# Altium schematic sheet 02_IO_Interface.SchDoc
size A3; SheetNumber: 3; SheetTotal: 3
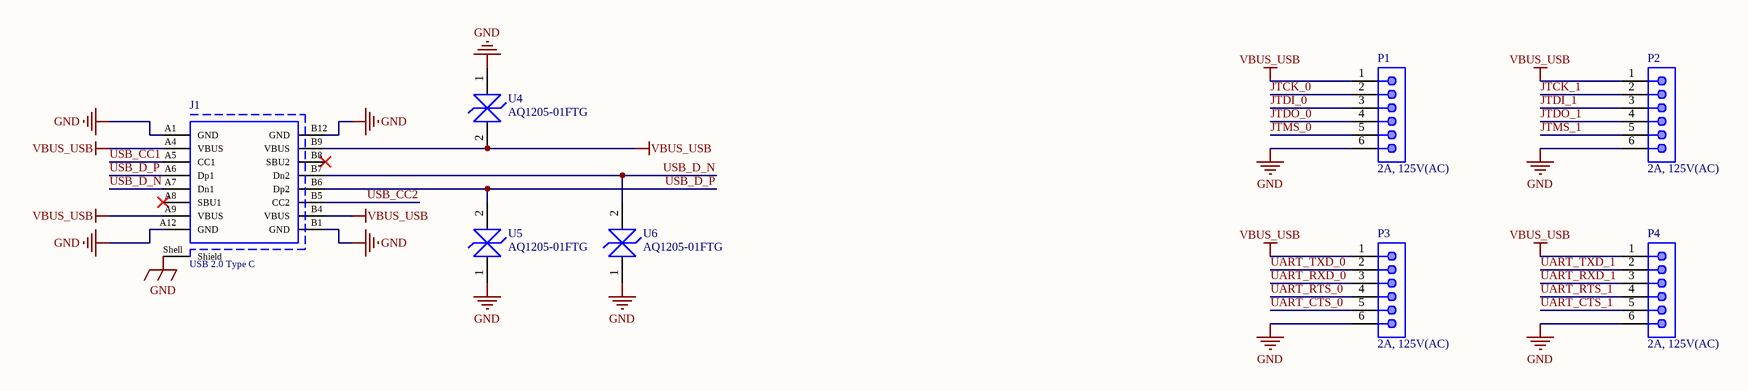
[diagram p0: 02_IO_Interface.SchDoc]

## Parts
J1  USB 2.0 Type C  [USB4105-GF-A]
P1  2A, 125V(AC)  [62000611622]
P2  2A, 125V(AC)  [62000611622]
P3  2A, 125V(AC)  [62000611622]
P4  2A, 125V(AC)  [62000611622]
U4  AQ1205-01FTG  [SOD323]
U5  AQ1205-01FTG  [SOD323]
U6  AQ1205-01FTG  [SOD323]

## Nets
GND: J1.A1(GND) J1.A12(GND) J1.B1(GND) J1.B12(GND) J1.Shell(Shield) P1.6 P2.6 P3.6 P4.6 U4.1 U5.1 U6.1
VBUS_USB: J1.A4(VBUS) J1.A9(VBUS) J1.B4(VBUS) J1.B9(VBUS) P1.1 P2.1 P3.1 P4.1 U4.2
JTCK_0: P1.2
JTCK_1: P2.2
JTDI_0: P1.3
JTDI_1: P2.3
JTDO_0: P1.4
JTDO_1: P2.4
JTMS_0: P1.5
JTMS_1: P2.5
UART_CTS_0: P3.5
UART_CTS_1: P4.5
UART_RTS_0: P3.4
UART_RTS_1: P4.4
UART_RXD_0: P3.3
UART_RXD_1: P4.3
UART_TXD_0: P3.2
UART_TXD_1: P4.2
USB_CC1: J1.A5(CC1)
USB_CC2: J1.B5(CC2)
USB_D_N: J1.A7(Dn1) J1.B7(Dn2) U6.2
USB_D_P: J1.A6(Dp1) J1.B6(Dp2) U5.2

Not connected (* = marked no-connect by the designer): J1 A8(SBU1)* B8(SBU2)*

## Notes on the sheet
- APPROVALS
- DATE
- PROJECT
- BOM:
- REFERENCE DOCUMENTS
- TITLE
- PROJECT REVISION
- DOCUMENT REVISION
- ASSY DWG:
- FAB DWG:
- PCB DWG:
- SIZE:
- A3
- FILE NAME:
- REV
- SHEET
- OF

## Library data of the parts
J1 = USB4105-GF-A: USB Connectors USB Type C,2.0, Rec,SMT, 0.95mmTH Shell Stakes,G/F,RA,Top Mnt,T&R; Manufacturer: GCT; Rated Current: 5 A; Gender: Receptacle; Contact Resistance: 30 mOhm; Working Voltage: 48 VDC; Number of Contacts: 16 Contact; Number of Ports: 1 Port; ComponentLink1Description: Datasheet; ComponentLink1URL: https://www.mouser.vn/datasheet/2/837/Global_Connector_Technology_usb4105-3106202.pdf; Published Date: September 2018; Orientation: Horizontal; Connector Type: USB 2.0 Type C; Operating Temperature: -40 to 105 degC; Packaging: Tape and Reel; Supplier 1 URL: https://www.mouser.vn/ProductDetail/GCT/USB4105-GF-A?qs=KUoIvG%2F9IlY%2FMLlBMpStpA%3D%3D; Supplier 2 URL: N/A; Supplier 3 SN: N/A; Supplier 3 URL: https://www.thegioiic.com/cong-usb-cai-3-1-type-c-16-chan-thang-dan-smd; Value: USB 2.0 Type C; LCSC Part #: C2765186; Manufacturer Part Number: USB4105-GF-A; Mount: SMD/SMT; Package / Case: N/A; Supplier 1: Mouser; Supplier 1 Part Number: 640-USB4105-GF-A; Supplier 2: Digi-Key; Supplier 2 Part Number: N/A; Supplier 3: thegioiic; Supplier 3 Part Number: N/A
P1-P4 = 62000611622: WR-WTB Male Vertical Shrouded Header, pitch 2mm, 6p; Manufacturer: Wurth Elektronik; Pin Number: 6; Contact Resistance: 20mOhm; Withstanding Voltage: 800VAC; Working Voltage: 125VAC; ComponentLink1Description: Datasheet; ComponentLink1URL: https://www.we-online.com/catalog/datasheet/62000611622.pdf; Pitch: 2mm; Packaging: Bag; Part Number: 62000611622; Gender: Male; Type: Vertical; Rated Current: 2A; Supplier 1 URL: https://www.mouser.vn/ProductDetail/Wurth-Elektronik/62000611622?qs=ulEaXIWI0c%2F38WR3e0VejA%3D%3D; Supplier 2 URL: N/A; Supplier 3 URL: https://www.thegioiic.com/dau-ph-2-0mm-6-chan-thang-xuyen-lo; Value: 2A, 125V(AC); LCSC Part #: N/A; Manufacturer Part Number: 62000611622; Mount: THT; Operating Temperature Max: + 85 C; Operating Temperature Min: - 25 C; Package / Case: 6; Supplier 1: Mouser; Supplier 1 Part Number: 710-62000611622; Supplier 2: Digi-Key; Supplier 2 Part Number: N/A; Supplier 3: thegioiic; Supplier 3 Part Number: N/A
U4-U6 = AQ1205-01FTG: ESD Suppressors / TVS Diodes 5V 7A 30kV SOD323 Bi-dir TVS; Manufacturer: Littelfuse; Breakdown Voltage: 5.1V; Clamping Voltage: 10V; Diode Capacitance: 7pF; Number of Channels: 1; ComponentLink1Description: Datasheet; ComponentLink1URL: https://www.mouser.vn/datasheet/2/240/media-3320499.pdf; Operating Temperature: -40 - 150; Peak Pulse Current: 7A; Peak Pulse Power Dissipation: N/A; Voltage ESD Air Gap: 30kV; Voltage ESD Contact: 30kV; Working Voltage: 5V; Supplier 1 URL: https://www.mouser.vn/ProductDetail/Littelfuse/AQ1205-01FTG?qs=tlsG%2FOw5FFgT817I6cPGrg%3D%3D; Supplier 2 URL: https://www.digikey.com/en/products/detail/littelfuse-inc/aq1205-01ftg/17128325; Supplier 3 URL: N/A; LCSC Part #: N/A; Manufacturer Part Number: AQ1205-01FTG; Mount: SMD/SMT; Operating Temperature Max: + 85 C; Operating Temperature Min: - 40 C; Packaging: Tape and Reel; Supplier 1: Mouser; Supplier 1 Part Number: 576-AQ1205-01FTG; Supplier 2: Digi-Key; Supplier 2 Part Number: 18-AQ1205-01FTGTR-ND; Supplier 3: thegioiic; Supplier 3 Part Number: N/A; Value: AQ1205-01FTG